# Altium project adapter_dongle.PrjPcb
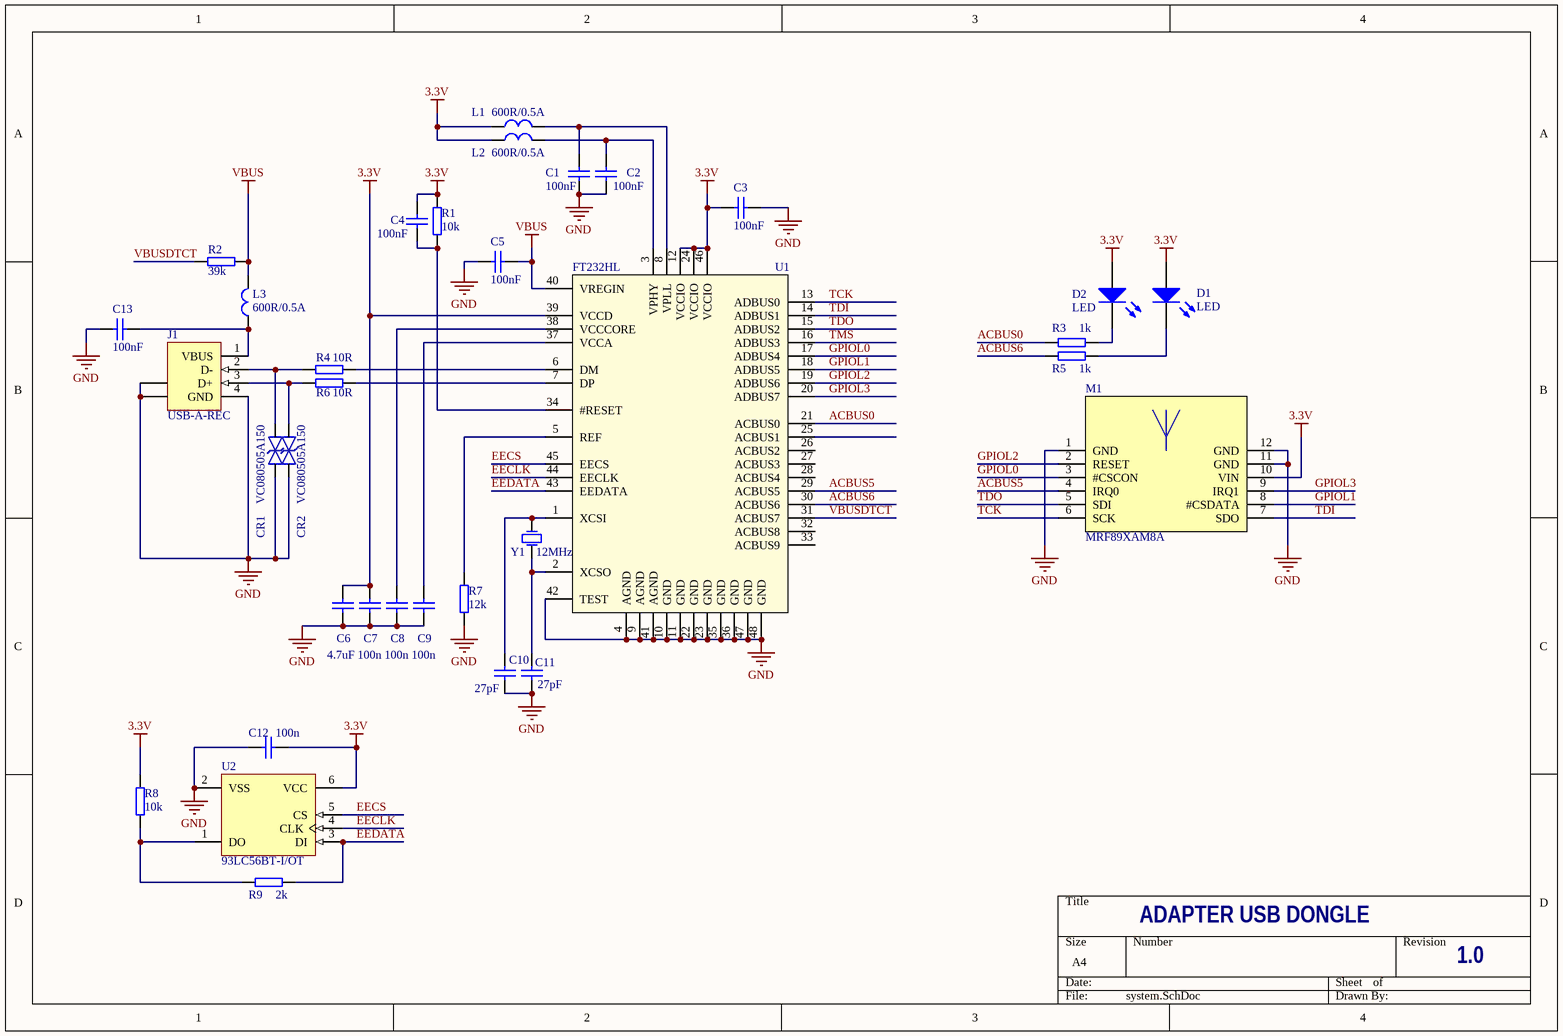
[diagram p0: system.SchDoc]
1 sheet, 34 parts. Net scope: global (net labels, ports and power ports of the same name join across sheets).
Board file: PCB.PcbDoc

## Sheet system.SchDoc
size A4

### Parts
C1  100nF  [C0805]
C2  100nF  [C0805]
C3  100nF  [C0805]
C4  100nF  [C0805]
C5  100nF  [C0805]
C6  4.7uF  [C0805]
C7  100n  [C0805]
C8  100n  [C0805]
C9  100n  [C0805]
C10  27pF  [C0805]
C11  27pF  [C0805]
C12  100n  [C0805]
C13  value 100nF  [C0805]  (hidden comment: 10nF)
CR1  VC080505A150  [R0805]
CR2  VC080505A150  [R0805]
D1  LED  [D0805]
D2  LED  [D0805]
J1  USB-A-REC  [USB/SM2.5-4H4A]
L1  600R/0.5A  [L0805]
L2  600R/0.5A  [L0805]
L3  600R/0.5A  [L0805]
M1  MRF89XAM8A  [MRF89XAM8A]
R1  10k  [R0805]
R2  39k  [R0805]
R3  1k  [R0805]
R4  10R  [R0805]
R5  1k  [R0805]
R6  10R  [R0805]
R7  12k  [R0805]
R8  10k  [R0805]
R9  2k  [R0805]
U1  FT232HL  [LQFP-48_M]
U2  93LC56BT-I/OT  [SOT-23-OT6_N]
Y1  12MHz  [OSC 5.0X3.2]

### Nets
3.3V: C3.2 C4.1 C6.1 C7.1 C12.2 D1.1(A) D2.1(A) L1.1 L2.1 M1.10(VIN) R1.2 R8.2 U1.12(VCCIO) U1.24(VCCIO) U1.39(VCCD) U1.46(VCCIO) U2.6(VCC)
GND: C1.2 C2.2 C3.1 C5.2 C6.2 C7.2 C8.2 C9.2 C10.2 C11.2 C12.1 C13.1 CR1.1 CR2.1 J1.4(GND) J1.5(SHLD) J1.6(SHLD) M1.1(GND) M1.11(GND) M1.12(GND) R7.1 U1.4(AGND) U1.9(AGND) U1.10(GND) U1.11(GND) U1.22(GND) U1.23(GND) U1.35(GND) U1.36(GND) U1.41(AGND) U1.42(TEST) U1.47(GND) U1.48(GND) U2.2(VSS)
VBUS: C5.1 L3.2 R2.1 U1.40(VREGIN)
ACBUS0: R3.1 U1.21(ACBUS0)
ACBUS5: M1.4(IRQ0) U1.29(ACBUS5)
ACBUS6: R5.1 U1.30(ACBUS6)
EECLK: U1.44(EECLK) U2.4(CLK)
EECS: U1.45(EECS) U2.5(CS)
EEDATA: R9.1 U1.43(EEDATA) U2.3(DI)
GPIOL0: M1.3(#CSCON) U1.17(ADBUS4)
GPIOL1: M1.8(#CSDATA) U1.18(ADBUS5)
GPIOL2: M1.2(RESET) U1.19(ADBUS6)
GPIOL3: M1.9(IRQ1) U1.20(ADBUS7)
TCK: M1.6(SCK) U1.13(ADBUS0)
TDI: M1.7(SDO) U1.14(ADBUS1)
TDO: M1.5(SDI) U1.15(ADBUS2)
TMS: U1.16(ADBUS3)
VBUSDTCT: R2.2 U1.31(ACBUS7)
NetC1_1: C1.1 L1.2 U1.8(VPLL)
NetC2_1: C2.1 L2.2 U1.3(VPHY)
NetC4_2: C4.2 R1.1 U1.34(#RESET)
NetC8_1: C8.1 U1.38(VCCCORE)
NetC9_1: C9.1 U1.37(VCCA)
NetC10_1: C10.1 U1.1(XCSI) Y1.3(OSC2)
NetC11_1: C11.1 U1.2(XCSO) Y1.1(OSC1)
NetC13_2: C13.2 J1.1(VBUS) L3.1
NetCR1_2: CR1.2 J1.2(D-) R4.1
NetCR2_2: CR2.2 J1.3(D+) R6.1
NetD1_2: D1.2(K) R5.2
NetD2_2: D2.2(K) R3.2
NetR4_2: R4.2 U1.6(DM)
NetR6_2: R6.2 U1.7(DP)
NetR7_2: R7.2 U1.5(REF)
NetR8_1: R8.1 R9.2 U2.1(DO)

Not connected (* = marked no-connect by the designer): U1 25(ACBUS1) 26(ACBUS2) 27(ACBUS3) 28(ACBUS4) 32(ACBUS8) 33(ACBUS9)

### Notes on the sheet
- ADAPTER USB DONGLE
- 1.0

### Library data of the parts
C1-C13 = Cap: Capacitor; Published: 8-Jun-2000; LatestRevisionDate: 17-Jul-2002; LatestRevisionNote: Re-released for DXP Platform.; PackageReference: 0402; Publisher: Altium Limited
  C1-C5: Value: 100nF
  C6: Value: 4.7uF
  C7-C9 C12: Value: 100n
  C10 C11: Value: 27pF
CR1 CR2 = ESD Protection: Multilayer Ceramic Transient Voltage Suppressors; TME: VC080505A150
D1 D2 = LED2: Typical RED, GREEN, YELLOW, AMBER GaAs LED; Published: 8-Jun-2000; LatestRevisionDate: 17-Jul-2002; LatestRevisionNote: Re-released for DXP Platform.; PackageDocument: Feb-2002; PackageReference: 0603; Publisher: Altium Limited
J1 = USB-A_MALE: USB 1.1, Right Angle, Thru-Hole, Reverse Type, 4 Position, Black; TerminationLength: 2.40mm [0.094in.]; PackageDocument: 18-Mar-2004; HousingMaterial: Glass-Filled Thermoplastic; TME: USBA-LP/SMD
L1-L3 = Inductor Ferrite Bead: Inductor Ferrite Bead, BLM18PG; Code_IEC: 1005; Value: 220Z; Published: 8-Jun-2000; LatestRevisionDate: 17-Jul-2002; LatestRevisionNote: Re-released for DXP Platform.; PackageReference: L0603; Publisher: Altium Limited; Code_JEITA: 0603; PackageDescription: Inductor SMD 0603; 1.6 x 0.8 mm; TME: MMZ2012R601A
M1 = MRF89XAM8A: 868 MHz Ultra-Low Power  Sub-GHz Transceiver Module; farnell: 1875307; TME: MRF89XAM8A-I/RM
R1-R9 = Res2: Resistor; Published: 8-Jun-2000; LatestRevisionDate: 17-Jul-2002; LatestRevisionNote: Re-released for DXP Platform.; PackageReference: 0603; Publisher: Altium Limited
  R1 R8: Value: 10k
  R2: Value: 39k
  R3 R5: Value: 1k
  R4 R6: Value: 10R
  R7: Value: 12k
  R9: Value: 2k; TME: SMD0805-2K-HP25
U1 = FT232HL: Single Channel HiSpeed USB to Multipurpose   UART/FIFO IC; TME: http://www.tme.eu/cz/details/ft232hl/integrovane-obvody-interface-usb/ftdi/ft232hl-tray/
U2 = 93LC56BT-I/OT: 2K, 128x16-bit, 2.5V Microwire Serial EEPROM, 6-Pin SOT-23, Industrial Temperature, Tape and Reel; FirstPublished: 29-Jan-2009; DatasheetVersion: revF, May-2008; PackageVersion: revBB, Aug-2009; PackageReference: SOT-23-OT6; Publisher: Altium Limited; PackageDescription: 6-Lead Plastic Small Outline Transistor (OT) [SOT-23]; Supplier 1: Digi-Key; Supplier Part Number 1: 93LC56BT-I/OTTR-ND; Supplier 2: Digi-Key; Supplier Part Number 2: 93LC56BT-I/OTCT-ND; Supplier 3: Digi-Key; Supplier Part Number 3: 93LC56BT-I/OTDKR-ND; Supplier 4: Farnell; Supplier Part Number 4: 1556165; Supplier 5: Newark; Supplier Part Number 5: 30H4760; Code_IPC: SOT26A-6; ComponentLink1Description: Datasheet; ComponentLink1URL: http://ww1.microchip.com/downloads/en/DeviceDoc/21794F.pdf; ComponentLink2Description: Packaging Specification; ComponentLink2URL: http://www.microchip.com/stellent/groups/techpub_sg/documents/packagingspec/en012702.pdf; ComponentLink3Description: Microchip.com Home; ComponentLink3URL: http://www.microchip.com/; TME: 93LC56BT-I/OT
Y1 = XTAL_ABM3: Crystal; Value: 25MHz; Published: 8-Jun-2000; LatestRevisionDate: 17-Jul-2002; LatestRevisionNote: Re-released for DXP Platform.; PackageReference: ABM8; Publisher: Altium Limited; ComponentLink1Description: Manufacturer Link; ComponentLink1URL: http://www.abracon.com; ComponentLink2Description: Datasheet; ComponentLink2URL: http://www.abracon.com/Resonators/abm8.pdf; PackageDescription: Oscilator Ceramic Package 3.2x2.5 mm; TME: ABM3B-12.000MHZ-B2